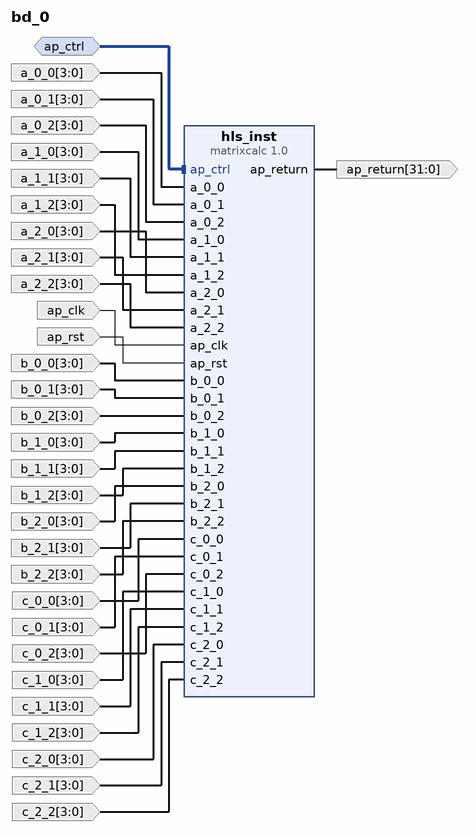
[diagram p0: block diagram of the top level]
# Vivado block design bd_0, xc7z020clg400-1, Vivado 2023.1
create_bd_design bd_0

create_bd_intf_port -mode Slave -vlnv xilinx.com:interface:acc_handshake_rtl:1.0 ap_ctrl
create_bd_port -dir I -from 3 -to 0 -type data a_0_0
create_bd_port -dir I -from 3 -to 0 -type data a_0_1
create_bd_port -dir I -from 3 -to 0 -type data a_0_2
create_bd_port -dir I -from 3 -to 0 -type data a_1_0
create_bd_port -dir I -from 3 -to 0 -type data a_1_1
create_bd_port -dir I -from 3 -to 0 -type data a_1_2
create_bd_port -dir I -from 3 -to 0 -type data a_2_0
create_bd_port -dir I -from 3 -to 0 -type data a_2_1
create_bd_port -dir I -from 3 -to 0 -type data a_2_2
create_bd_port -dir I -type clk ap_clk
set_property -dict {CONFIG.FREQ_HZ 125000000.0} [get_bd_ports ap_clk]
create_bd_port -dir O -from 31 -to 0 -type data ap_return
create_bd_port -dir I -type rst ap_rst
set_property -dict {CONFIG.POLARITY ACTIVE_HIGH} [get_bd_ports ap_rst]
create_bd_port -dir I -from 3 -to 0 -type data b_0_0
create_bd_port -dir I -from 3 -to 0 -type data b_0_1
create_bd_port -dir I -from 3 -to 0 -type data b_0_2
create_bd_port -dir I -from 3 -to 0 -type data b_1_0
create_bd_port -dir I -from 3 -to 0 -type data b_1_1
create_bd_port -dir I -from 3 -to 0 -type data b_1_2
create_bd_port -dir I -from 3 -to 0 -type data b_2_0
create_bd_port -dir I -from 3 -to 0 -type data b_2_1
create_bd_port -dir I -from 3 -to 0 -type data b_2_2
create_bd_port -dir I -from 3 -to 0 -type data c_0_0
create_bd_port -dir I -from 3 -to 0 -type data c_0_1
create_bd_port -dir I -from 3 -to 0 -type data c_0_2
create_bd_port -dir I -from 3 -to 0 -type data c_1_0
create_bd_port -dir I -from 3 -to 0 -type data c_1_1
create_bd_port -dir I -from 3 -to 0 -type data c_1_2
create_bd_port -dir I -from 3 -to 0 -type data c_2_0
create_bd_port -dir I -from 3 -to 0 -type data c_2_1
create_bd_port -dir I -from 3 -to 0 -type data c_2_2

create_bd_cell -type ip -vlnv xilinx.com:hls:matrixcalc:1.0 hls_inst

# ---- connections ----

connect_bd_intf_net -intf_net ap_ctrl_0_1 [get_bd_intf_ports ap_ctrl] [get_bd_intf_pins hls_inst/ap_ctrl]
connect_bd_net -net a_0_0_0_1 [get_bd_ports a_0_0] [get_bd_pins hls_inst/a_0_0]
connect_bd_net -net a_0_1_0_1 [get_bd_ports a_0_1] [get_bd_pins hls_inst/a_0_1]
connect_bd_net -net a_0_2_0_1 [get_bd_ports a_0_2] [get_bd_pins hls_inst/a_0_2]
connect_bd_net -net a_1_0_0_1 [get_bd_ports a_1_0] [get_bd_pins hls_inst/a_1_0]
connect_bd_net -net a_1_1_0_1 [get_bd_ports a_1_1] [get_bd_pins hls_inst/a_1_1]
connect_bd_net -net a_1_2_0_1 [get_bd_ports a_1_2] [get_bd_pins hls_inst/a_1_2]
connect_bd_net -net a_2_0_0_1 [get_bd_ports a_2_0] [get_bd_pins hls_inst/a_2_0]
connect_bd_net -net a_2_1_0_1 [get_bd_ports a_2_1] [get_bd_pins hls_inst/a_2_1]
connect_bd_net -net a_2_2_0_1 [get_bd_ports a_2_2] [get_bd_pins hls_inst/a_2_2]
connect_bd_net -net ap_clk_0_1 [get_bd_ports ap_clk] [get_bd_pins hls_inst/ap_clk]
connect_bd_net -net ap_rst_0_1 [get_bd_ports ap_rst] [get_bd_pins hls_inst/ap_rst]
connect_bd_net -net b_0_0_0_1 [get_bd_ports b_0_0] [get_bd_pins hls_inst/b_0_0]
connect_bd_net -net b_0_1_0_1 [get_bd_ports b_0_1] [get_bd_pins hls_inst/b_0_1]
connect_bd_net -net b_0_2_0_1 [get_bd_ports b_0_2] [get_bd_pins hls_inst/b_0_2]
connect_bd_net -net b_1_0_0_1 [get_bd_ports b_1_0] [get_bd_pins hls_inst/b_1_0]
connect_bd_net -net b_1_1_0_1 [get_bd_ports b_1_1] [get_bd_pins hls_inst/b_1_1]
connect_bd_net -net b_1_2_0_1 [get_bd_ports b_1_2] [get_bd_pins hls_inst/b_1_2]
connect_bd_net -net b_2_0_0_1 [get_bd_ports b_2_0] [get_bd_pins hls_inst/b_2_0]
connect_bd_net -net b_2_1_0_1 [get_bd_ports b_2_1] [get_bd_pins hls_inst/b_2_1]
connect_bd_net -net b_2_2_0_1 [get_bd_ports b_2_2] [get_bd_pins hls_inst/b_2_2]
connect_bd_net -net c_0_0_0_1 [get_bd_ports c_0_0] [get_bd_pins hls_inst/c_0_0]
connect_bd_net -net c_0_1_0_1 [get_bd_ports c_0_1] [get_bd_pins hls_inst/c_0_1]
connect_bd_net -net c_0_2_0_1 [get_bd_ports c_0_2] [get_bd_pins hls_inst/c_0_2]
connect_bd_net -net c_1_0_0_1 [get_bd_ports c_1_0] [get_bd_pins hls_inst/c_1_0]
connect_bd_net -net c_1_1_0_1 [get_bd_ports c_1_1] [get_bd_pins hls_inst/c_1_1]
connect_bd_net -net c_1_2_0_1 [get_bd_ports c_1_2] [get_bd_pins hls_inst/c_1_2]
connect_bd_net -net c_2_0_0_1 [get_bd_ports c_2_0] [get_bd_pins hls_inst/c_2_0]
connect_bd_net -net c_2_1_0_1 [get_bd_ports c_2_1] [get_bd_pins hls_inst/c_2_1]
connect_bd_net -net c_2_2_0_1 [get_bd_ports c_2_2] [get_bd_pins hls_inst/c_2_2]
connect_bd_net [get_bd_pins hls_inst/ap_return] [get_bd_ports ap_return]

validate_bd_design
save_bd_design
